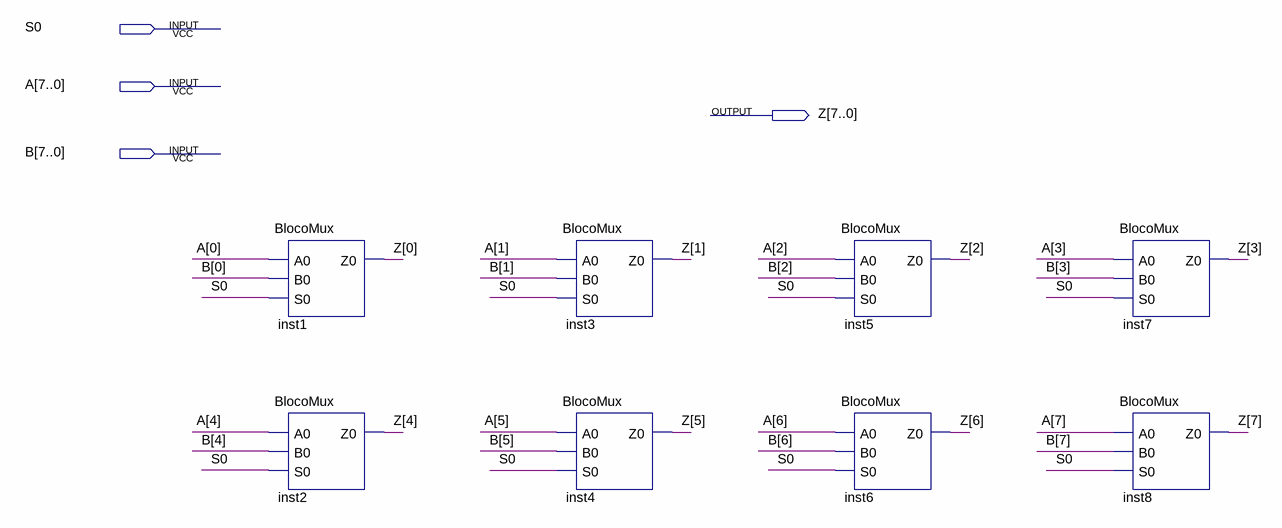
[diagram p0: schematic sheet]
// Quartus schematic MUX2X1_8b.bdf as structural Verilog: 8 symbols, 4 pins
module MUX2X1_8b (
  input  S0,
  input  [7:0] A,
  input  [7:0] B,
  output [7:0] Z
);

  BlocoMux inst1 (.A0(A[0]), .B0(B[0]), .S0(S0), .Z0(Z[0]));
  BlocoMux inst2 (.A0(A[4]), .B0(B[4]), .S0(S0), .Z0(Z[4]));
  BlocoMux inst3 (.A0(A[1]), .B0(B[1]), .S0(S0), .Z0(Z[1]));
  BlocoMux inst4 (.A0(A[5]), .B0(B[5]), .S0(S0), .Z0(Z[5]));
  BlocoMux inst5 (.A0(A[2]), .B0(B[2]), .S0(S0), .Z0(Z[2]));
  BlocoMux inst6 (.A0(A[6]), .B0(B[6]), .S0(S0), .Z0(Z[6]));
  BlocoMux inst7 (.A0(A[3]), .B0(B[3]), .S0(S0), .Z0(Z[3]));
  BlocoMux inst8 (.A0(A[7]), .B0(B[7]), .S0(S0), .Z0(Z[7]));
endmodule
